# EAGLE design Facec (EAGLE 6.1)
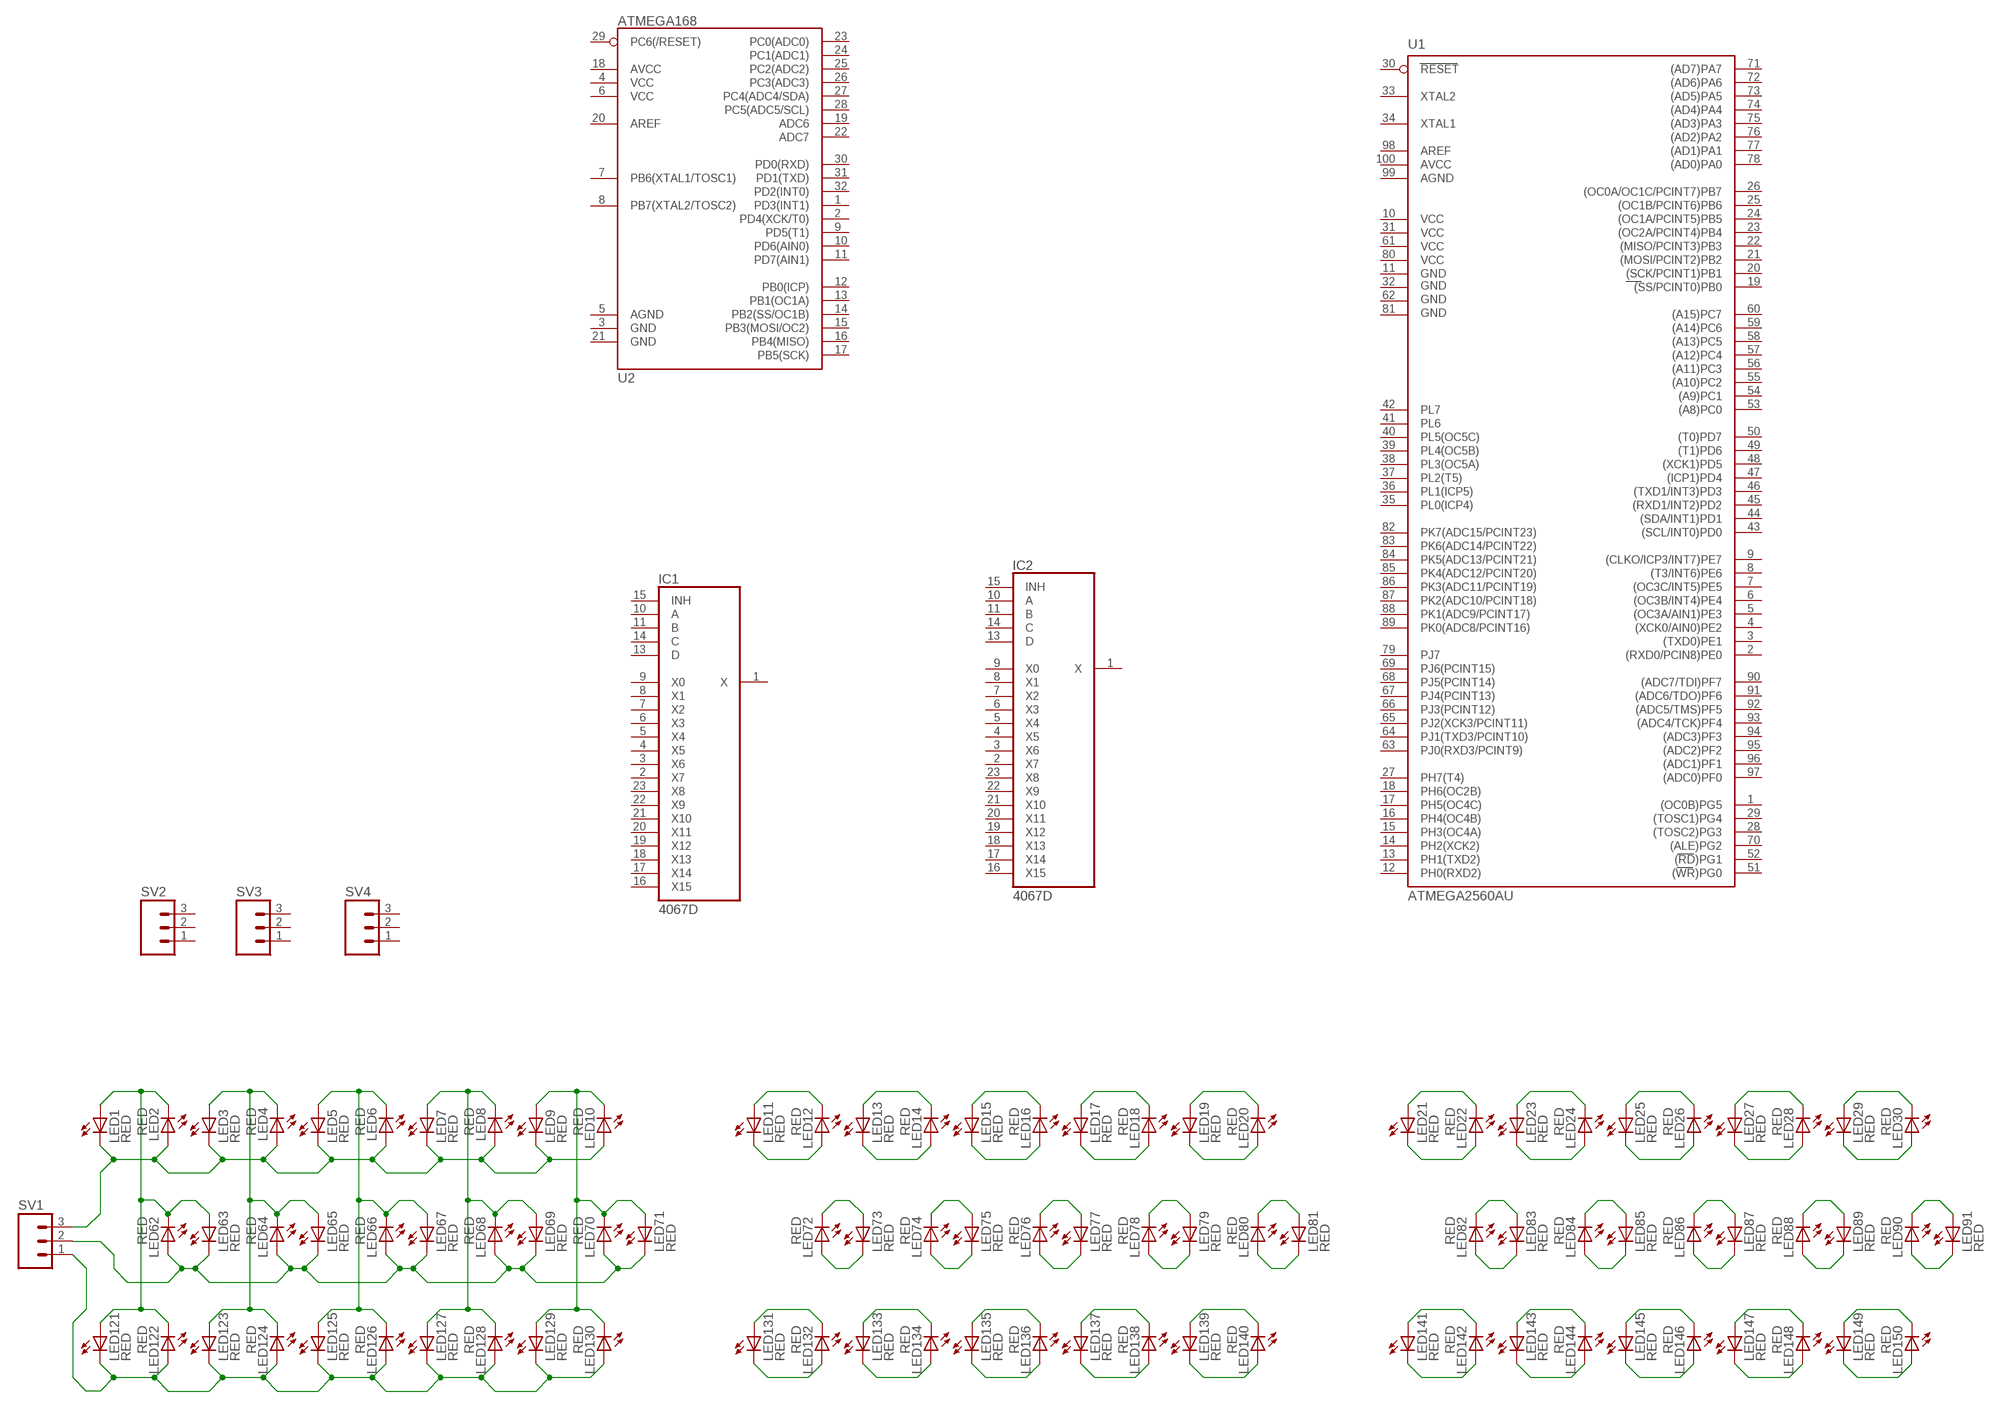
[diagram p0: schematic, sheet 1, part 1 of 2]
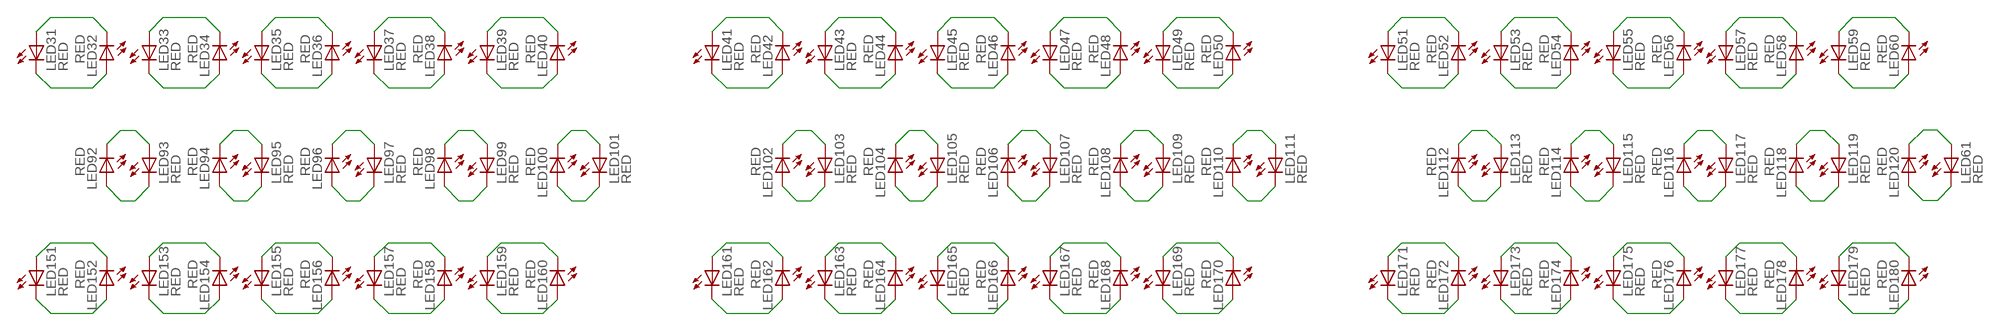
[diagram p1: schematic, sheet 1, part 2 of 2]

## Parts
IC1  4067D  [SO24W]
IC2  4067D  [SO24W]
LED1  RED  LED0603  [LED-0603]
LED2  RED  LED0603  [LED-0603]
LED3  RED  LED0603  [LED-0603]
LED4  RED  LED0603  [LED-0603]
LED5  RED  LED0603  [LED-0603]
LED6  RED  LED0603  [LED-0603]
LED7  RED  LED0603  [LED-0603]
LED8  RED  LED0603  [LED-0603]
LED9  RED  LED0603  [LED-0603]
LED10  RED  LED0603  [LED-0603]
LED11  RED  LED0603  [LED-0603]
LED12  RED  LED0603  [LED-0603]
LED13  RED  LED0603  [LED-0603]
LED14  RED  LED0603  [LED-0603]
LED15  RED  LED0603  [LED-0603]
LED16  RED  LED0603  [LED-0603]
LED17  RED  LED0603  [LED-0603]
LED18  RED  LED0603  [LED-0603]
LED19  RED  LED0603  [LED-0603]
LED20  RED  LED0603  [LED-0603]
LED21  RED  LED0603  [LED-0603]
LED22  RED  LED0603  [LED-0603]
LED23  RED  LED0603  [LED-0603]
LED24  RED  LED0603  [LED-0603]
LED25  RED  LED0603  [LED-0603]
LED26  RED  LED0603  [LED-0603]
LED27  RED  LED0603  [LED-0603]
LED28  RED  LED0603  [LED-0603]
LED29  RED  LED0603  [LED-0603]
LED30  RED  LED0603  [LED-0603]
LED31  RED  LED0603  [LED-0603]
LED32  RED  LED0603  [LED-0603]
LED33  RED  LED0603  [LED-0603]
LED34  RED  LED0603  [LED-0603]
LED35  RED  LED0603  [LED-0603]
LED36  RED  LED0603  [LED-0603]
LED37  RED  LED0603  [LED-0603]
LED38  RED  LED0603  [LED-0603]
LED39  RED  LED0603  [LED-0603]
LED40  RED  LED0603  [LED-0603]
LED41  RED  LED0603  [LED-0603]
LED42  RED  LED0603  [LED-0603]
LED43  RED  LED0603  [LED-0603]
LED44  RED  LED0603  [LED-0603]
LED45  RED  LED0603  [LED-0603]
LED46  RED  LED0603  [LED-0603]
LED47  RED  LED0603  [LED-0603]
LED48  RED  LED0603  [LED-0603]
LED49  RED  LED0603  [LED-0603]
LED50  RED  LED0603  [LED-0603]
LED51  RED  LED0603  [LED-0603]
LED52  RED  LED0603  [LED-0603]
LED53  RED  LED0603  [LED-0603]
LED54  RED  LED0603  [LED-0603]
LED55  RED  LED0603  [LED-0603]
LED56  RED  LED0603  [LED-0603]
LED57  RED  LED0603  [LED-0603]
LED58  RED  LED0603  [LED-0603]
LED59  RED  LED0603  [LED-0603]
LED60  RED  LED0603  [LED-0603]
LED61  RED  LED0603  [LED-0603]
LED62  RED  LED0603  [LED-0603]
LED63  RED  LED0603  [LED-0603]
LED64  RED  LED0603  [LED-0603]
LED65  RED  LED0603  [LED-0603]
LED66  RED  LED0603  [LED-0603]
LED67  RED  LED0603  [LED-0603]
LED68  RED  LED0603  [LED-0603]
LED69  RED  LED0603  [LED-0603]
LED70  RED  LED0603  [LED-0603]
LED71  RED  LED0603  [LED-0603]
LED72  RED  LED0603  [LED-0603]
LED73  RED  LED0603  [LED-0603]
LED74  RED  LED0603  [LED-0603]
LED75  RED  LED0603  [LED-0603]
LED76  RED  LED0603  [LED-0603]
LED77  RED  LED0603  [LED-0603]
LED78  RED  LED0603  [LED-0603]
LED79  RED  LED0603  [LED-0603]
LED80  RED  LED0603  [LED-0603]
LED81  RED  LED0603  [LED-0603]
LED82  RED  LED0603  [LED-0603]
LED83  RED  LED0603  [LED-0603]
LED84  RED  LED0603  [LED-0603]
LED85  RED  LED0603  [LED-0603]
LED86  RED  LED0603  [LED-0603]
LED87  RED  LED0603  [LED-0603]
LED88  RED  LED0603  [LED-0603]
LED89  RED  LED0603  [LED-0603]
LED90  RED  LED0603  [LED-0603]
LED91  RED  LED0603  [LED-0603]
LED92  RED  LED0603  [LED-0603]
LED93  RED  LED0603  [LED-0603]
LED94  RED  LED0603  [LED-0603]
LED95  RED  LED0603  [LED-0603]
LED96  RED  LED0603  [LED-0603]
LED97  RED  LED0603  [LED-0603]
LED98  RED  LED0603  [LED-0603]
LED99  RED  LED0603  [LED-0603]
LED100  RED  LED0603  [LED-0603]
LED101  RED  LED0603  [LED-0603]
LED102  RED  LED0603  [LED-0603]
LED103  RED  LED0603  [LED-0603]
LED104  RED  LED0603  [LED-0603]
LED105  RED  LED0603  [LED-0603]
LED106  RED  LED0603  [LED-0603]
LED107  RED  LED0603  [LED-0603]
LED108  RED  LED0603  [LED-0603]
LED109  RED  LED0603  [LED-0603]
LED110  RED  LED0603  [LED-0603]
LED111  RED  LED0603  [LED-0603]
LED112  RED  LED0603  [LED-0603]
LED113  RED  LED0603  [LED-0603]
LED114  RED  LED0603  [LED-0603]
LED115  RED  LED0603  [LED-0603]
LED116  RED  LED0603  [LED-0603]
LED117  RED  LED0603  [LED-0603]
LED118  RED  LED0603  [LED-0603]
LED119  RED  LED0603  [LED-0603]
LED120  RED  LED0603  [LED-0603]
LED121  RED  LED0603  [LED-0603]
LED122  RED  LED0603  [LED-0603]
LED123  RED  LED0603  [LED-0603]
LED124  RED  LED0603  [LED-0603]
LED125  RED  LED0603  [LED-0603]
LED126  RED  LED0603  [LED-0603]
LED127  RED  LED0603  [LED-0603]
LED128  RED  LED0603  [LED-0603]
LED129  RED  LED0603  [LED-0603]
LED130  RED  LED0603  [LED-0603]
LED131  RED  LED0603  [LED-0603]
LED132  RED  LED0603  [LED-0603]
LED133  RED  LED0603  [LED-0603]
LED134  RED  LED0603  [LED-0603]
LED135  RED  LED0603  [LED-0603]
LED136  RED  LED0603  [LED-0603]
LED137  RED  LED0603  [LED-0603]
LED138  RED  LED0603  [LED-0603]
LED139  RED  LED0603  [LED-0603]
LED140  RED  LED0603  [LED-0603]
LED141  RED  LED0603  [LED-0603]
LED142  RED  LED0603  [LED-0603]
LED143  RED  LED0603  [LED-0603]
LED144  RED  LED0603  [LED-0603]
LED145  RED  LED0603  [LED-0603]
LED146  RED  LED0603  [LED-0603]
LED147  RED  LED0603  [LED-0603]
LED148  RED  LED0603  [LED-0603]
LED149  RED  LED0603  [LED-0603]
LED150  RED  LED0603  [LED-0603]
LED151  RED  LED0603  [LED-0603]
LED152  RED  LED0603  [LED-0603]
LED153  RED  LED0603  [LED-0603]
LED154  RED  LED0603  [LED-0603]
LED155  RED  LED0603  [LED-0603]
LED156  RED  LED0603  [LED-0603]
LED157  RED  LED0603  [LED-0603]
LED158  RED  LED0603  [LED-0603]
LED159  RED  LED0603  [LED-0603]
LED160  RED  LED0603  [LED-0603]
LED161  RED  LED0603  [LED-0603]
LED162  RED  LED0603  [LED-0603]
LED163  RED  LED0603  [LED-0603]
LED164  RED  LED0603  [LED-0603]
LED165  RED  LED0603  [LED-0603]
LED166  RED  LED0603  [LED-0603]
LED167  RED  LED0603  [LED-0603]
LED168  RED  LED0603  [LED-0603]
LED169  RED  LED0603  [LED-0603]
LED170  RED  LED0603  [LED-0603]
LED171  RED  LED0603  [LED-0603]
LED172  RED  LED0603  [LED-0603]
LED173  RED  LED0603  [LED-0603]
LED174  RED  LED0603  [LED-0603]
LED175  RED  LED0603  [LED-0603]
LED176  RED  LED0603  [LED-0603]
LED177  RED  LED0603  [LED-0603]
LED178  RED  LED0603  [LED-0603]
LED179  RED  LED0603  [LED-0603]
LED180  RED  LED0603  [LED-0603]
SV1  M03PTH  [1X03]
SV2  M03PTH  [1X03]
SV3  M03PTH  [1X03]
SV4  M03PTH  [1X03]
U1  ATMEGA2560AU  [TQFP100]
U2  ATMEGA168  [TQFP32-08]

## Nets
N$1: LED1.A LED2.C LED62.C LED63.A LED121.A LED122.C
N$2: LED3.A LED4.C LED64.C LED65.A LED123.A LED124.C
N$3: LED5.A LED6.C LED66.C LED67.A LED125.A LED126.C
N$4: LED7.A LED8.C LED68.C LED69.A LED127.A LED128.C
N$5: LED9.A LED10.C LED70.C LED71.A LED129.A LED130.C
N$6: LED11.A LED12.C
N$7: LED13.A LED14.C
N$8: LED15.A LED16.C
N$9: LED17.A LED18.C
N$10: LED19.A LED20.C
N$11: LED21.A LED22.C
N$12: LED23.A LED24.C
N$13: LED25.A LED26.C
N$14: LED27.A LED28.C
N$15: LED29.A LED30.C
N$16: LED31.A LED32.C
N$17: LED33.A LED34.C
N$18: LED35.A LED36.C
N$19: LED37.A LED38.C
N$20: LED39.A LED40.C
N$21: LED41.A LED42.C
N$22: LED43.A LED44.C
N$23: LED45.A LED46.C
N$24: LED47.A LED48.C
N$25: LED49.A LED50.C
N$26: LED51.A LED52.C
N$27: LED53.A LED54.C
N$28: LED55.A LED56.C
N$29: LED57.A LED58.C
N$30: LED59.A LED60.C
N$31: LED121.C LED122.A LED123.C LED124.A LED125.C LED126.A LED127.C LED128.A LED129.C LED130.A SV1.1
N$36: LED72.C LED73.A
N$37: LED74.C LED75.A
N$38: LED76.C LED77.A
N$39: LED78.C LED79.A
N$40: LED80.C LED81.A
N$41: LED82.C LED83.A
N$42: LED84.C LED85.A
N$43: LED86.C LED87.A
N$44: LED88.C LED89.A
N$45: LED90.C LED91.A
N$46: LED92.C LED93.A
N$47: LED94.C LED95.A
N$48: LED96.C LED97.A
N$49: LED98.C LED99.A
N$50: LED100.C LED101.A
N$51: LED102.C LED103.A
N$52: LED104.C LED105.A
N$53: LED106.C LED107.A
N$54: LED108.C LED109.A
N$55: LED110.C LED111.A
N$56: LED112.C LED113.A
N$57: LED114.C LED115.A
N$58: LED116.C LED117.A
N$59: LED118.C LED119.A
N$60: LED61.A LED120.C
N$66: LED131.A LED132.C
N$67: LED133.A LED134.C
N$68: LED135.A LED136.C
N$69: LED137.A LED138.C
N$70: LED139.A LED140.C
N$71: LED141.A LED142.C
N$72: LED143.A LED144.C
N$73: LED145.A LED146.C
N$74: LED147.A LED148.C
N$75: LED149.A LED150.C
N$76: LED151.A LED152.C
N$77: LED153.A LED154.C
N$78: LED155.A LED156.C
N$79: LED157.A LED158.C
N$80: LED159.A LED160.C
N$81: LED161.A LED162.C
N$82: LED163.A LED164.C
N$83: LED165.A LED166.C
N$84: LED167.A LED168.C
N$85: LED169.A LED170.C
N$86: LED171.A LED172.C
N$87: LED173.A LED174.C
N$88: LED175.A LED176.C
N$89: LED177.A LED178.C
N$90: LED179.A LED180.C
N$91: LED1.C LED2.A LED3.C LED4.A LED5.C LED6.A LED7.C LED8.A LED9.C LED10.A SV1.3
N$96: LED11.C LED12.A
N$97: LED13.C LED14.A
N$98: LED15.C LED16.A
N$99: LED17.C LED18.A
N$100: LED19.C LED20.A
N$101: LED21.C LED22.A
N$102: LED23.C LED24.A
N$103: LED25.C LED26.A
N$104: LED27.C LED28.A
N$105: LED29.C LED30.A
N$106: LED31.C LED32.A
N$107: LED33.C LED34.A
N$108: LED35.C LED36.A
N$109: LED37.C LED38.A
N$110: LED39.C LED40.A
N$111: LED41.C LED42.A
N$112: LED43.C LED44.A
N$113: LED45.C LED46.A
N$114: LED47.C LED48.A
N$115: LED49.C LED50.A
N$116: LED51.C LED52.A
N$117: LED53.C LED54.A
N$118: LED55.C LED56.A
N$119: LED57.C LED58.A
N$120: LED59.C LED60.A
N$121: LED62.A LED63.C LED64.A LED65.C LED66.A LED67.C LED68.A LED69.C LED70.A LED71.C SV1.2
N$126: LED72.A LED73.C
N$127: LED74.A LED75.C
N$128: LED76.A LED77.C
N$129: LED78.A LED79.C
N$130: LED80.A LED81.C
N$131: LED82.A LED83.C
N$132: LED84.A LED85.C
N$133: LED86.A LED87.C
N$134: LED88.A LED89.C
N$135: LED90.A LED91.C
N$136: LED92.A LED93.C
N$137: LED94.A LED95.C
N$138: LED96.A LED97.C
N$139: LED98.A LED99.C
N$140: LED100.A LED101.C
N$141: LED102.A LED103.C
N$142: LED104.A LED105.C
N$143: LED106.A LED107.C
N$144: LED108.A LED109.C
N$145: LED110.A LED111.C
N$146: LED112.A LED113.C
N$147: LED114.A LED115.C
N$148: LED116.A LED117.C
N$149: LED118.A LED119.C
N$150: LED61.C LED120.A
N$156: LED131.C LED132.A
N$157: LED133.C LED134.A
N$158: LED135.C LED136.A
N$159: LED137.C LED138.A
N$160: LED139.C LED140.A
N$161: LED141.C LED142.A
N$162: LED143.C LED144.A
N$163: LED145.C LED146.A
N$164: LED147.C LED148.A
N$165: LED149.C LED150.A
N$166: LED151.C LED152.A
N$167: LED153.C LED154.A
N$168: LED155.C LED156.A
N$169: LED157.C LED158.A
N$170: LED159.C LED160.A
N$171: LED161.C LED162.A
N$172: LED163.C LED164.A
N$173: LED165.C LED166.A
N$174: LED167.C LED168.A
N$175: LED169.C LED170.A
N$176: LED171.C LED172.A
N$177: LED173.C LED174.A
N$178: LED175.C LED176.A
N$179: LED177.C LED178.A
N$180: LED179.C LED180.A
Unconnected: IC1.1(X) IC1.2(X7) IC1.3(X6) IC1.4(X5) IC1.5(X4) IC1.6(X3) IC1.7(X2) IC1.8(X1) IC1.9(X0) IC1.10(A) IC1.11(B) IC1.13(D) IC1.14(C) IC1.15(INH) IC1.16(X15) IC1.17(X14) IC1.18(X13) IC1.19(X12) IC1.20(X11) IC1.21(X10) IC1.22(X9) IC1.23(X8) IC2.1(X) IC2.2(X7) IC2.3(X6) IC2.4(X5) IC2.5(X4) IC2.6(X3) IC2.7(X2) IC2.8(X1) IC2.9(X0) IC2.10(A) IC2.11(B) IC2.13(D) IC2.14(C) IC2.15(INH) IC2.16(X15) IC2.17(X14) IC2.18(X13) IC2.19(X12) IC2.20(X11) IC2.21(X10) IC2.22(X9) IC2.23(X8) SV2.1 SV2.2 SV2.3 SV3.1 SV3.2 SV3.3 SV4.1 SV4.2 SV4.3 U1.1((OC0B)PG5) U1.2((RXD0/PCIN8)PE0) U1.3((TXD0)PE1) U1.4((XCK0/AIN0)PE2) U1.5((OC3A/AIN1)PE3) U1.6((OC3B/INT4)PE4) U1.7((OC3C/INT5)PE5) U1.8((T3/INT6)PE6) U1.9((CLKO/ICP3/INT7)PE7) U1.12(PH0(RXD2)) U1.13(PH1(TXD2)) U1.14(PH2(XCK2)) U1.15(PH3(OC4A)) U1.16(PH4(OC4B)) U1.17(PH5(OC4C)) U1.18(PH6(OC2B)) U1.19((SS/PCINT0)PB0) U1.20((SCK/PCINT1)PB1) U1.21((MOSI/PCINT2)PB2) U1.22((MISO/PCINT3)PB3) U1.23((OC2A/PCINT4)PB4) U1.24((OC1A/PCINT5)PB5) U1.25((OC1B/PCINT6)PB6) U1.26((OC0A/OC1C/PCINT7)PB7) U1.27(PH7(T4)) U1.28((TOSC2)PG3) U1.29((TOSC1)PG4) U1.30(RESET) U1.33(XTAL2) U1.34(XTAL1) U1.35(PL0(ICP4)) U1.36(PL1(ICP5)) U1.37(PL2(T5)) U1.38(PL3(OC5A)) U1.39(PL4(OC5B)) U1.40(PL5(OC5C)) U1.41(PL6) U1.42(PL7) U1.43((SCL/INT0)PD0) U1.44((SDA/INT1)PD1) U1.45((RXD1/INT2)PD2) U1.46((TXD1/INT3)PD3) U1.47((ICP1)PD4) U1.48((XCK1)PD5) U1.49((T1)PD6) U1.50((T0)PD7) U1.51((WR)PG0) U1.52((RD)PG1) U1.53((A8)PC0) U1.54((A9)PC1) U1.55((A10)PC2) U1.56((A11)PC3) U1.57((A12)PC4) U1.58((A13)PC5) U1.59((A14)PC6) U1.60((A15)PC7) U1.63(PJ0(RXD3/PCINT9)) U1.64(PJ1(TXD3/PCINT10)) U1.65(PJ2(XCK3/PCINT11)) U1.66(PJ3(PCINT12)) U1.67(PJ4(PCINT13)) U1.68(PJ5(PCINT14)) U1.69(PJ6(PCINT15)) U1.70((ALE)PG2) U1.71((AD7)PA7) U1.72((AD6)PA6) U1.73((AD5)PA5) U1.74((AD4)PA4) U1.75((AD3)PA3) U1.76((AD2)PA2) U1.77((AD1)PA1) U1.78((AD0)PA0) U1.79(PJ7) U1.82(PK7(ADC15/PCINT23)) U1.83(PK6(ADC14/PCINT22)) U1.84(PK5(ADC13/PCINT21)) U1.85(PK4(ADC12/PCINT20)) U1.86(PK3(ADC11/PCINT19)) U1.87(PK2(ADC10/PCINT18)) U1.88(PK1(ADC9/PCINT17)) U1.89(PK0(ADC8/PCINT16)) U1.90((ADC7/TDI)PF7) U1.91((ADC6/TDO)PF6) U1.92((ADC5/TMS)PF5) U1.93((ADC4/TCK)PF4) U1.94((ADC3)PF3) U1.95((ADC2)PF2) U1.96((ADC1)PF1) U1.97((ADC0)PF0) U1.98(AREF) U2.1(PD3(INT1)) U2.2(PD4(XCK/T0)) U2.3(GND) U2.4(VCC) U2.5(AGND) U2.6(VCC) U2.7(PB6(XTAL1/TOSC1)) U2.8(PB7(XTAL2/TOSC2)) U2.9(PD5(T1)) U2.10(PD6(AIN0)) U2.11(PD7(AIN1)) U2.12(PB0(ICP)) U2.13(PB1(OC1A)) U2.14(PB2(SS/OC1B)) U2.15(PB3(MOSI/OC2)) U2.16(PB4(MISO)) U2.17(PB5(SCK)) U2.18(AVCC) U2.19(ADC6) U2.20(AREF) U2.21(GND) U2.22(ADC7) U2.23(PC0(ADC0)) U2.24(PC1(ADC1)) U2.25(PC2(ADC2)) U2.26(PC3(ADC3)) U2.27(PC4(ADC4/SDA)) U2.28(PC5(ADC5/SCL)) U2.29(PC6(/RESET)) U2.30(PD0(RXD)) U2.31(PD1(TXD)) U2.32(PD2(INT0))

## Power pins joined to a net without a drawn wire
AGND: U1.99(AGND)
AVCC: U1.100(AVCC)
GND: U1.11(GND)
GND1: U1.32(GND1)
GND2: U1.62(GND2)
GND3: U1.81(GND3)
VCC: U1.10(VCC)
VCC1: U1.31(VCC1)
VCC2: U1.61(VCC2)
VCC3: U1.80(VCC3)
VDD: IC1.24(VDD) IC2.24(VDD)
VSS: IC1.12(VSS) IC2.12(VSS)

## Library data of the parts
IC1 IC2 = 40xx:4067: 16-channel ANALOG MULTIPLEXER
LED1-LED180 = SparkFun-LED:LED: LEDs Standard schematic elements and footprints for 5mm, 3mm, 1206, and 0603 sized LEDs. 5mm - Spark Fun Electronics SKU : COM-00529 (and others)
SV1-SV4 = SparkFun-Connectors:M03: Header 3 Standard 3-pin 0.1" header. Use with straight break away headers (SKU : PRT-00116), right angle break away headers (PRT-00553), swiss pins (PRT-00743), machine pins (PRT-00117), and female headers (PRT-00115). Molex polarized connector foot print use with SKU : PRT-08232 with associated crimp pins and housings.
U1 = SparkFun-DigitalIC:ATMEGA2560: Atmel 100-pin 8-bit uC 64/128/256 Kbytes FLASH 4 Kbytes EEPROM 8 Kbytes SRAM 86 General Purpose I/O pins 12-channels16-bit PWM 4 x Serial USARTs 16-channels 10-bit A/D
U2 = SparkFun-DigitalIC:ATMEGA168: Atmel 32-pin 8-bit micro, 16k flash.

## Board
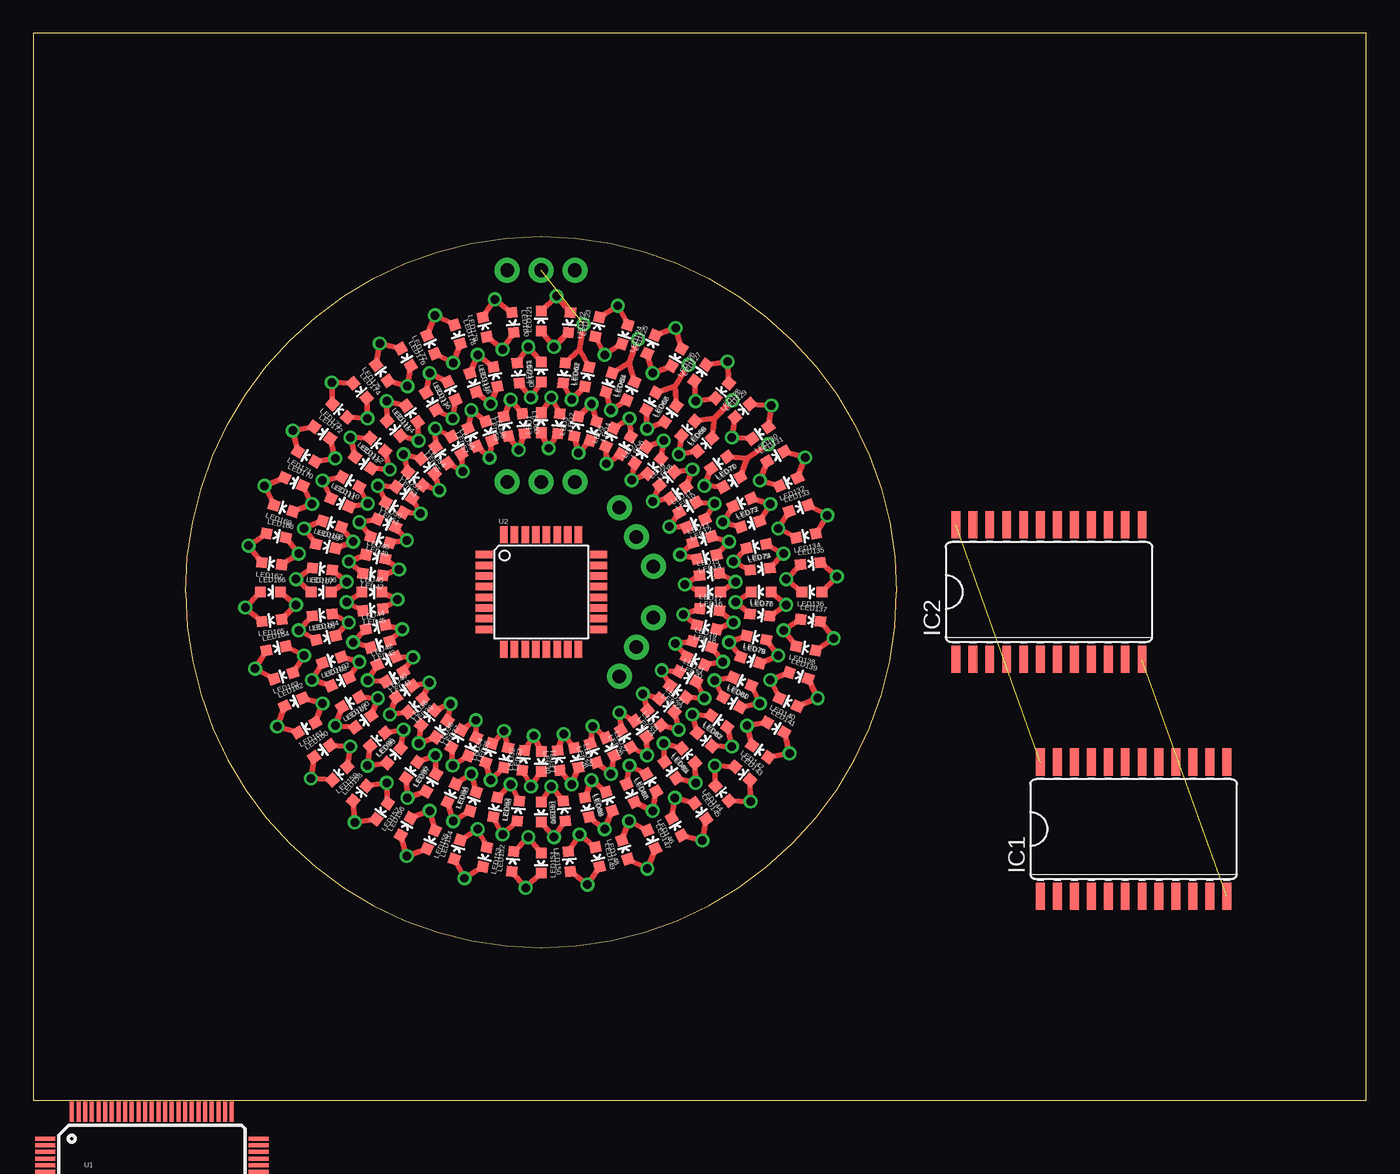
[diagram p2: board, top side]
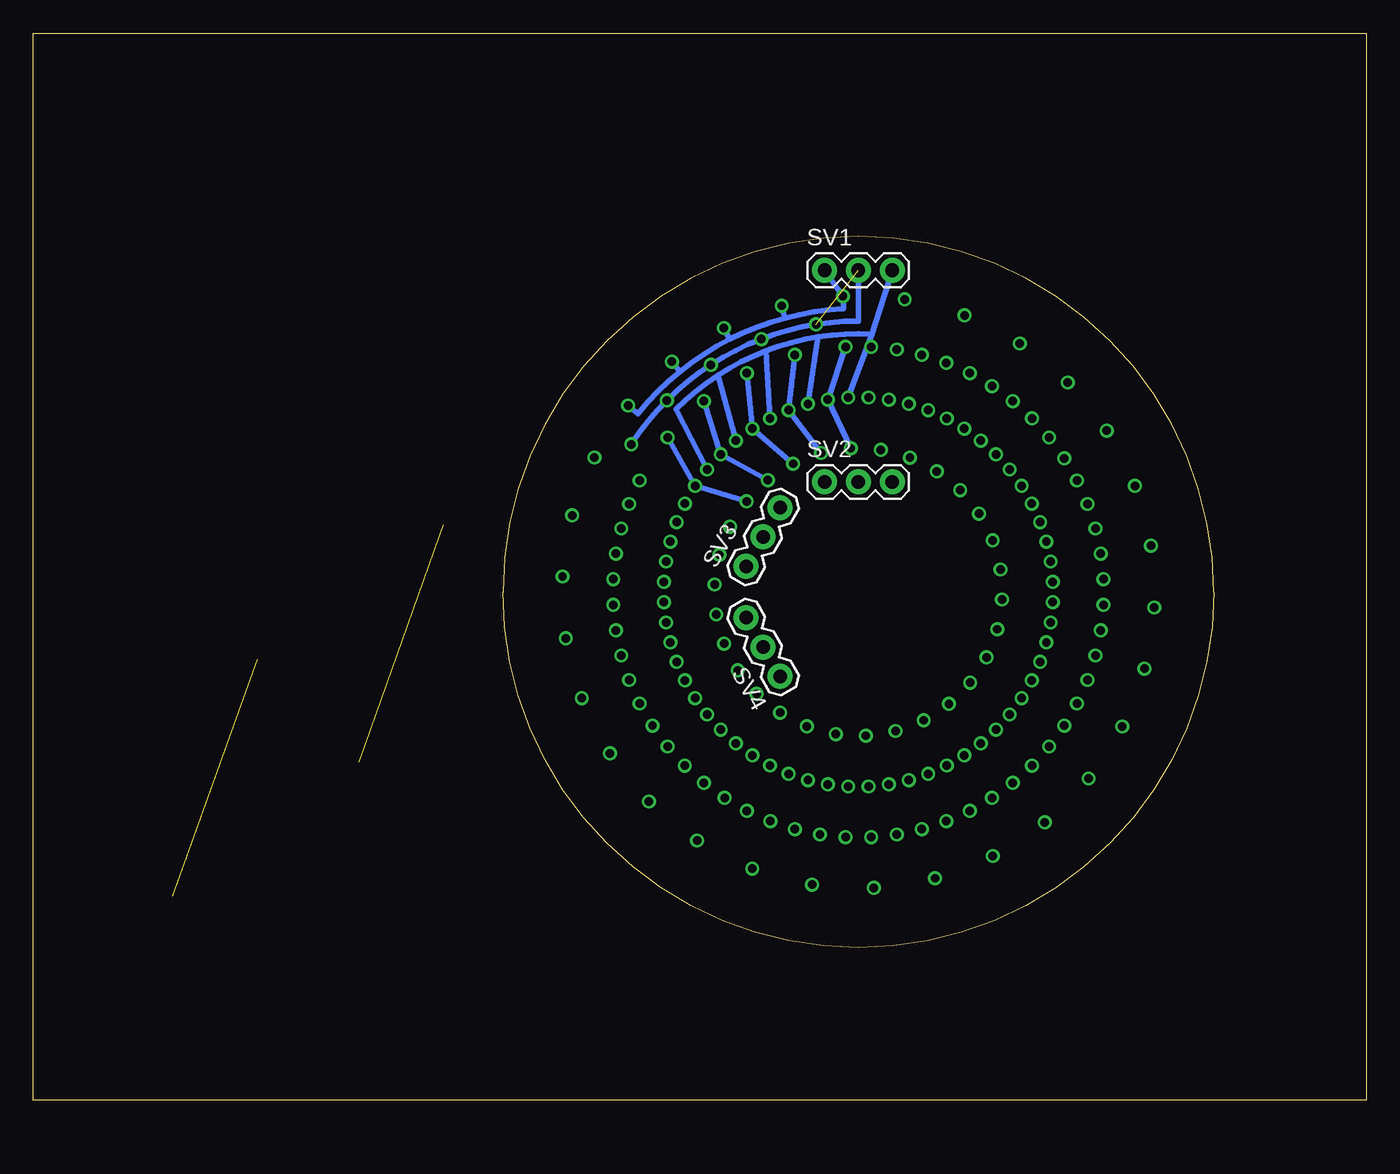
[diagram p3: board, bottom side, seen from below]

Size 100 x 80 mm. Coordinates in mm from the lower left corner, seen from the top.
Outline: 0,0 100,0 100,80 0,80 0,0
Outline: 11.43,38.1 arc180 64.77,38.1 arc180 11.43,38.1
Copper layers (1*16): Top 0.035mm / dielectric 1.5mm / Bottom 0.035mm
Design rules: minimum track width 10mil, minimum drill 24mil, track to track 8mil, track to pad 8mil, pad to pad 8mil, via to via 8mil, smd to smd 8mil, copper to edge 40mil, drill to drill 8mil, minimum pad ring 10mil, minimum via ring 8mil, stop-mask expansion 4mil, vias tented up to drill 0mil, thermal gap 10mil

### Footprints (pad centres in the part's own frame; a part is rotated, then mirrored left to right if it is on the bottom)
SO24W = smd 0.66 x 2.032: 1 -6.985,-5.029; 2 -5.715,-5.029; 3 -4.445,-5.029; 4 -3.175,-5.029; 5 -1.905,-5.029; 6 -0.635,-5.029; 7 0.635,-5.029; 8 1.905,-5.029; 9 3.175,-5.029; 10 4.445,-5.029; 11 5.715,-5.029; 12 6.985,-5.029; 13 6.985,5.029; 14 5.715,5.029; 15 4.445,5.029; 16 3.175,5.029; 17 1.905,5.029; 18 0.635,5.029; 19 -0.635,5.029; 20 -1.905,5.029; 21 -3.175,5.029; 22 -4.445,5.029; 23 -5.715,5.029; 24 -6.985,5.029
LED-0603 = smd 0.8 x 0.8: A 0,-0.75; C 0,0.75
1X03 = drill 1.016 pad 1.88: 1 0,0; 2 2.54,0; 3 5.08,0
TQFP100 = smd 1.5 x 0.3: 1 -8,6; 2 -8,5.5; 3 -8,5; 4 -8,4.5; 5 -8,4; 6 -8,3.5; 7 -8,3; 8 -8,2.5; 9 -8,2; 10 -8,1.5; 11 -8,1; 12 -8,0.5; 13 -8,0; 14 -8,-0.5; 15 -8,-1; 16 -8,-1.5; 17 -8,-2; 18 -8,-2.5; 19 -8,-3; 20 -8,-3.5; 21 -8,-4; 22 -8,-4.5; 23 -8,-5; 24 -8,-5.5; 25 -8,-6; 51 8,-6; 52 8,-5.5; 53 8,-5; 54 8,-4.5; 55 8,-4; 56 8,-3.5; 57 8,-3; 58 8,-2.5; 59 8,-2; 60 8,-1.5; 61 8,-1; 62 8,-0.5; 63 8,0; 64 8,0.5; 65 8,1; 66 8,1.5; 67 8,2; 68 8,2.5; 69 8,3; 70 8,3.5; 71 8,4; 72 8,4.5; 73 8,5; 74 8,5.5; 75 8,6 | smd 0.3 x 1.5: 26 -6,-8; 27 -5.5,-8; 28 -5,-8; 29 -4.5,-8; 30 -4,-8; 31 -3.5,-8; 32 -3,-8; 33 -2.5,-8; 34 -2,-8; 35 -1.5,-8; 36 -1,-8; 37 -0.5,-8; 38 0,-8; 39 0.5,-8; 40 1,-8; 41 1.5,-8; 42 2,-8; 43 2.5,-8; 44 3,-8; 45 3.5,-8; 46 4,-8; 47 4.5,-8; 48 5,-8; 49 5.5,-8; 50 6,-8; 76 6,8; 77 5.5,8; 78 5,8; 79 4.5,8; 80 4,8; 81 3.5,8; 82 3,8; 83 2.5,8; 84 2,8; 85 1.5,8; 86 1,8; 87 0.5,8; 88 0,8; 89 -0.5,8; 90 -1,8; 91 -1.5,8; 92 -2,8; 93 -2.5,8; 94 -3,8; 95 -3.5,8; 96 -4,8; 97 -4.5,8; 98 -5,8; 99 -5.5,8; 100 -6,8
TQFP32-08 = smd 1.27 x 0.559: 1 -4.293,2.8; 2 -4.293,2; 3 -4.293,1.2; 4 -4.293,0.4; 5 -4.293,-0.4; 6 -4.293,-1.2; 7 -4.293,-2; 8 -4.293,-2.8; 17 4.293,-2.8; 18 4.293,-2; 19 4.293,-1.2; 20 4.293,-0.4; 21 4.293,0.4; 22 4.293,1.2; 23 4.293,2; 24 4.293,2.8 | smd 0.559 x 1.27: 9 -2.8,-4.293; 10 -2,-4.293; 11 -1.2,-4.293; 12 -0.4,-4.293; 13 0.4,-4.293; 14 1.2,-4.293; 15 2,-4.293; 16 2.8,-4.293; 25 2.8,4.293; 26 2,4.293; 27 1.2,4.293; 28 0.4,4.293; 29 -0.4,4.293; 30 -1.2,4.293; 31 -2,4.293; 32 -2.8,4.293

### Placement (x,y rotation side)
IC1  82.55,20.32 0 top
IC2  76.2,38.1 0 top
LED1  38.1,50.8 0 top
LED2  39.43,50.73 174 top
LED3  40.74,50.52 348 top
LED4  42.02,50.18 162 top
LED5  43.27,49.7 336 top
LED6  44.45,49.1 150 top
LED7  45.56,48.37 324 top
LED8  46.6,47.54 138 top
LED9  47.54,46.6 312 top
LED10  48.37,45.56 126 top
LED11  49.1,44.45 300 top
LED12  49.7,43.27 114 top
LED13  50.18,42.02 288 top
LED14  50.52,40.74 102 top
LED15  50.73,39.43 276 top
LED16  50.8,38.1 90 top
LED17  50.73,36.77 264 top
LED18  50.52,35.46 78 top
LED19  50.18,34.18 252 top
LED20  49.7,32.93 66 top
LED21  49.1,31.75 240 top
LED22  48.37,30.64 54 top
LED23  47.54,29.6 228 top
LED24  46.6,28.66 42 top
LED25  45.56,27.83 216 top
LED26  44.45,27.1 30 top
LED27  43.27,26.5 204 top
LED28  42.02,26.02 18 top
LED29  40.74,25.68 192 top
LED30  39.43,25.47 6 top
LED31  38.1,25.4 180 top
LED32  36.77,25.47 354 top
LED33  35.46,25.68 168 top
LED34  34.18,26.02 342 top
LED35  32.93,26.5 156 top
LED36  31.75,27.1 330 top
LED37  30.64,27.83 144 top
LED38  29.6,28.66 318 top
LED39  28.66,29.6 132 top
LED40  27.83,30.64 306 top
LED41  27.1,31.75 120 top
LED42  26.5,32.93 294 top
LED43  26.02,34.18 108 top
LED44  25.68,35.46 282 top
LED45  25.47,36.77 96 top
LED46  25.4,38.1 270 top
LED47  25.47,39.43 84 top
LED48  25.68,40.74 258 top
LED49  26.02,42.02 72 top
LED50  26.5,43.27 246 top
LED51  27.1,44.45 60 top
LED52  27.83,45.56 234 top
LED53  28.66,46.6 48 top
LED54  29.6,47.54 222 top
LED55  30.64,48.37 36 top
LED56  31.75,49.1 210 top
LED57  32.93,49.7 24 top
LED58  34.18,50.18 198 top
LED59  35.46,50.52 12 top
LED60  36.77,50.73 186 top
LED61  38.1,54.61 0 top
LED62  39.83,54.52 174 top
LED63  41.53,54.25 348 top
LED64  43.2,53.8 162 top
LED65  44.82,53.18 336 top
LED66  46.35,52.4 150 top
LED67  47.8,51.46 324 top
LED68  49.15,50.37 138 top
LED69  50.37,49.15 312 top
LED70  51.46,47.8 126 top
LED71  52.4,46.35 300 top
LED72  53.18,44.82 114 top
LED73  53.8,43.2 288 top
LED74  54.25,41.53 102 top
LED75  54.52,39.83 276 top
LED76  54.61,38.1 90 top
LED77  54.52,36.37 264 top
LED78  54.25,34.67 78 top
LED79  53.8,33 252 top
LED80  53.18,31.38 66 top
LED81  52.4,29.84 240 top
LED82  51.46,28.4 54 top
LED83  50.37,27.05 228 top
LED84  49.15,25.83 42 top
LED85  47.8,24.74 216 top
LED86  46.35,23.8 30 top
LED87  44.82,23.02 204 top
LED88  43.2,22.4 18 top
LED89  41.53,21.95 192 top
LED90  39.83,21.68 6 top
LED91  38.1,21.59 180 top
LED92  36.37,21.68 354 top
LED93  34.67,21.95 168 top
LED94  33,22.4 342 top
LED95  31.38,23.02 156 top
LED96  29.84,23.8 330 top
LED97  28.4,24.74 144 top
LED98  27.05,25.83 318 top
LED99  25.83,27.05 132 top
LED100  24.74,28.4 306 top
LED101  23.8,29.84 120 top
LED102  23.02,31.38 294 top
LED103  22.4,33 108 top
LED104  21.95,34.67 282 top
LED105  21.68,36.37 96 top
LED106  21.59,38.1 270 top
LED107  21.68,39.83 84 top
LED108  21.95,41.53 258 top
LED109  22.4,43.2 72 top
LED110  23.02,44.82 246 top
LED111  23.8,46.35 60 top
LED112  24.74,47.8 234 top
LED113  25.83,49.15 48 top
LED114  27.05,50.37 222 top
LED115  28.4,51.46 36 top
LED116  29.84,52.4 210 top
LED117  31.38,53.18 24 top
LED118  33,53.8 198 top
LED119  34.67,54.25 12 top
LED120  36.37,54.52 186 top
LED121  38.1,58.42 0 top
LED122  40.22,58.31 174 top
LED123  42.32,57.98 348 top
LED124  44.38,57.43 162 top
LED125  46.36,56.66 336 top
LED126  48.26,55.7 150 top
LED127  50.04,54.54 324 top
LED128  51.7,53.2 138 top
LED129  53.2,51.7 312 top
LED130  54.54,50.04 126 top
LED131  55.7,48.26 300 top
LED132  56.66,46.36 114 top
LED133  57.43,44.38 288 top
LED134  57.98,42.32 102 top
LED135  58.31,40.22 276 top
LED136  58.42,38.1 90 top
LED137  58.31,35.98 264 top
LED138  57.98,33.88 78 top
LED139  57.43,31.82 252 top
LED140  56.66,29.84 66 top
LED141  55.7,27.94 240 top
LED142  54.54,26.16 54 top
LED143  53.2,24.5 228 top
LED144  51.7,23 42 top
LED145  50.04,21.66 216 top
LED146  48.26,20.5 30 top
LED147  46.36,19.54 204 top
LED148  44.38,18.77 18 top
LED149  42.32,18.22 192 top
LED150  40.22,17.89 6 top
LED151  38.1,17.78 180 top
LED152  35.98,17.89 354 top
LED153  33.88,18.22 168 top
LED154  31.82,18.77 342 top
LED155  29.84,19.54 156 top
LED156  27.94,20.5 330 top
LED157  26.16,21.66 144 top
LED158  24.5,23 318 top
LED159  23,24.5 132 top
LED160  21.66,26.16 306 top
LED161  20.5,27.94 120 top
LED162  19.54,29.84 294 top
LED163  18.77,31.82 108 top
LED164  18.22,33.88 282 top
LED165  17.89,35.98 96 top
LED166  17.78,38.1 270 top
LED167  17.89,40.22 84 top
LED168  18.22,42.32 258 top
LED169  18.77,44.38 72 top
LED170  19.54,46.36 246 top
LED171  20.5,48.26 60 top
LED172  21.66,50.04 234 top
LED173  23,51.7 48 top
LED174  24.5,53.2 222 top
LED175  26.16,54.54 36 top
LED176  27.94,55.7 210 top
LED177  29.84,56.66 24 top
LED178  31.82,57.43 198 top
LED179  33.88,57.98 12 top
LED180  35.98,58.31 186 top
SV1  40.64,62.23 0 bottom
SV2  40.64,46.35 0 bottom
SV3  46.52,40.03 60 bottom
SV4  43.98,31.77 120 bottom
U1  8.89,-8.89 0 top
U2  38.1,38.1 0 top

### Tracks (layer width: path | path; a pad name or v marks a point on that pad's centre or on a via)
N$1  (via drill 0.64)
  Top 0.406: LED63.A v40.38,52.52 LED62.C | LED1.A v38.66,48.88 LED2.C | LED121.A v39.06,56.49 LED122.C
  Bottom 0.406: v38.66,48.88 v40.38,52.52 v39.06,56.49
N$2  (via drill 0.64)
  Top 0.406: LED4.C v40.89,48.53 LED3.A | LED124.C v42.87,55.89 LED123.A | LED65.A v43.33,51.73 LED64.C
  Bottom 0.406: v42.87,55.89 v43.33,51.73 v40.89,48.53
N$3  (via drill 0.64)
  Top 0.406: LED5.A v43,47.72 LED6.C | LED125.A v46.46,54.51 LED126.C | LED66.C v46.05,50.35 LED67.A
  Bottom 0.406: v43,47.72 v46.05,50.35 v46.46,54.51
N$4  (via drill 0.64)
  Top 0.406: LED7.A v44.89,46.49 LED8.C | LED127.A v49.69,52.41 LED128.C | LED68.C v48.43,48.43 LED69.A
  Bottom 0.406: v49.69,52.41 v48.43,48.43 v44.89,46.49
N$5  (via drill 0.64)
  Top 0.406: LED9.A v46.49,44.89 LED10.C | LED129.A v52.41,49.69 LED130.C | LED70.C v50.35,46.05 LED71.A
  Bottom 0.406: v46.49,44.89 v50.35,46.05 v52.41,49.69
N$6  (via drill 0.64)
  Top 0.406: LED11.A v47.72,43 LED12.C
N$7  (via drill 0.64)
  Top 0.406: LED13.A v48.53,40.89 LED14.C
N$8  (via drill 0.64)
  Top 0.406: LED15.A v48.88,38.66 LED16.C
N$9  (via drill 0.64)
  Top 0.406: LED17.A v48.76,36.41 LED18.C
N$10  (via drill 0.64)
  Top 0.406: LED19.A v48.18,34.23 LED20.C
N$11  (via drill 0.64)
  Top 0.406: LED21.A v47.15,32.22 LED22.C
N$12  (via drill 0.64)
  Top 0.406: LED23.A v45.73,30.47 LED24.C
N$13  (via drill 0.64)
  Top 0.406: LED25.A v43.98,29.05 LED26.C
N$14  (via drill 0.64)
  Top 0.406: LED27.A v41.97,28.02 LED28.C
N$15  (via drill 0.64)
  Top 0.406: LED29.A v39.79,27.44 LED30.C
N$16  (via drill 0.64)
  Top 0.406: LED31.A v37.53,27.32 LED32.C
N$17  (via drill 0.64)
  Top 0.406: LED33.A v35.31,27.67 LED34.C
N$18  (via drill 0.64)
  Top 0.406: LED35.A v33.2,28.48 LED36.C
N$19  (via drill 0.64)
  Top 0.406: LED37.A v31.31,29.71 LED38.C
N$20  (via drill 0.64)
  Top 0.406: LED39.A v29.71,31.31 LED40.C
N$21  (via drill 0.64)
  Top 0.406: LED41.A v28.48,33.2 LED42.C
N$22  (via drill 0.64)
  Top 0.406: LED43.A v27.67,35.31 LED44.C
N$23  (via drill 0.64)
  Top 0.406: LED46.C v27.32,37.53 LED45.A
N$24  (via drill 0.64)
  Top 0.406: LED48.C v27.44,39.79 LED47.A
N$25  (via drill 0.64)
  Top 0.406: LED50.C v28.02,41.97 LED49.A
N$26  (via drill 0.64)
  Top 0.406: LED52.C v29.05,43.98 LED51.A
N$27  (via drill 0.64)
  Top 0.406: LED54.C v30.47,45.73 LED53.A
N$28  (via drill 0.64)
  Top 0.406: LED56.C v32.22,47.15 LED55.A
N$29  (via drill 0.64)
  Top 0.406: LED58.C v34.23,48.18 LED57.A
N$30  (via drill 0.64)
  Top 0.406: LED59.A v36.41,48.76 LED60.C
N$31  (via drill 0.64)
  Top 0.406: LED121.C v39.26,60.3 LED122.A | LED123.C v43.85,59.57 LED124.A | LED126.A v48.19,57.9 LED125.C | LED128.A v52.09,55.37 LED127.C | LED129.C v55.37,52.09 LED130.A
  Bottom 0.406: v43.85,59.57 43.61,58.65 | v48.19,57.9 47.76,57.05 | v52.09,55.37 51.49,54.63 | v55.37,52.09 54.63,51.49 arc12 51.49,54.63 | 43.61,58.65 arc12 39.21,59.34 v39.26,60.3 SV1.1 | 43.61,58.65 arc-12 47.76,57.05 | 51.49,54.63 arc12 47.76,57.05
N$36  (via drill 0.64)
  Top 0.406: LED72.C v51.73,43.33 LED73.A
N$37  (via drill 0.64)
  Top 0.406: LED74.C v52.52,40.38 LED75.A
N$38  (via drill 0.64)
  Top 0.406: LED76.C v52.69,37.34 LED77.A
N$39  (via drill 0.64)
  Top 0.406: LED78.C v52.21,34.32 LED79.A
N$40  (via drill 0.64)
  Top 0.406: LED80.C v51.11,31.47 LED81.A
N$41  (via drill 0.64)
  Top 0.406: LED82.C v49.45,28.91 LED83.A
N$42  (via drill 0.64)
  Top 0.406: LED84.C v47.29,26.75 LED85.A
N$43  (via drill 0.64)
  Top 0.406: LED86.C v44.73,25.09 LED87.A
N$44  (via drill 0.64)
  Top 0.406: LED88.C v41.88,23.99 LED89.A
N$45  (via drill 0.64)
  Top 0.406: LED90.C v38.86,23.52 LED91.A
N$46  (via drill 0.64)
  Top 0.406: LED92.C v35.81,23.68 LED93.A
N$47  (via drill 0.64)
  Top 0.406: LED94.C v32.87,24.46 LED95.A
N$48  (via drill 0.64)
  Top 0.406: LED96.C v30.15,25.85 LED97.A
N$49  (via drill 0.64)
  Top 0.406: LED98.C v27.77,27.77 LED99.A
N$50  (via drill 0.64)
  Top 0.406: LED100.C v25.85,30.15 LED101.A
N$51  (via drill 0.64)
  Top 0.406: LED103.A v24.46,32.87 LED102.C
N$52  (via drill 0.64)
  Top 0.406: LED105.A v23.68,35.81 LED104.C
N$53  (via drill 0.64)
  Top 0.406: LED106.C v23.52,38.86 LED107.A
N$54  (via drill 0.64)
  Top 0.406: LED109.A v23.99,41.88 LED108.C
N$55  (via drill 0.64)
  Top 0.406: LED111.A v25.09,44.73 LED110.C
N$56  (via drill 0.64)
  Top 0.406: LED113.A v26.75,47.29 LED112.C
N$57  (via drill 0.64)
  Top 0.406: LED115.A v28.91,49.45 LED114.C
N$58  (via drill 0.64)
  Top 0.406: LED117.A v31.47,51.11 LED116.C
N$59  (via drill 0.64)
  Top 0.406: LED119.A v34.32,52.21 LED118.C
N$60  (via drill 0.64)
  Top 0.406: LED61.A v37.34,52.69 LED120.C
N$66  (via drill 0.64)
  Top 0.406: LED132.C v54.51,46.46 LED131.A
N$67  (via drill 0.64)
  Top 0.406: LED133.A v55.89,42.87 LED134.C
N$68  (via drill 0.64)
  Top 0.406: LED135.A v56.49,39.06 LED136.C
N$69  (via drill 0.64)
  Top 0.406: LED137.A v56.29,35.22 LED138.C
N$70  (via drill 0.64)
  Top 0.406: LED139.A v55.29,31.5 LED140.C
N$71  (via drill 0.64)
  Top 0.406: LED141.A v53.54,28.07 LED142.C
N$72  (via drill 0.64)
  Top 0.406: LED143.A v51.12,25.08 LED144.C
N$73  (via drill 0.64)
  Top 0.406: LED145.A v48.13,22.66 LED146.C
N$74  (via drill 0.64)
  Top 0.406: LED147.A v44.7,20.91 LED148.C
N$75  (via drill 0.64)
  Top 0.406: LED149.A v40.98,19.91 LED150.C
N$76  (via drill 0.64)
  Top 0.406: LED151.A v37.14,19.71 LED152.C
N$77  (via drill 0.64)
  Top 0.406: LED153.A v33.33,20.31 LED154.C
N$78  (via drill 0.64)
  Top 0.406: LED156.C v29.74,21.69 LED155.A
N$79  (via drill 0.64)
  Top 0.406: LED157.A v26.51,23.79 LED158.C
N$80  (via drill 0.64)
  Top 0.406: LED159.A v23.79,26.51 LED160.C
N$81  (via drill 0.64)
  Top 0.406: LED161.A v21.69,29.74 LED162.C
N$82  (via drill 0.64)
  Top 0.406: LED164.C v20.31,33.33 LED163.A
N$83  (via drill 0.64)
  Top 0.406: LED166.C v19.71,37.14 LED165.A
N$84  (via drill 0.64)
  Top 0.406: LED168.C v19.91,40.98 LED167.A
N$85  (via drill 0.64)
  Top 0.406: LED170.C v20.91,44.7 LED169.A
N$86  (via drill 0.64)
  Top 0.406: LED172.C v22.66,48.13 LED171.A
N$87  (via drill 0.64)
  Top 0.406: LED173.A v25.08,51.12 LED174.C
N$88  (via drill 0.64)
  Top 0.406: LED176.C v28.07,53.54 LED175.A
N$89  (via drill 0.64)
  Top 0.406: LED178.C v31.5,55.29 LED177.A
N$90  (via drill 0.64)
  Top 0.406: LED180.C v35.22,56.29 LED179.A
N$91  (via drill 0.64)
  Top 0.406: LED1.C v38.86,52.69 LED2.A | LED3.C v41.88,52.21 LED4.A | LED5.C v44.73,51.11 LED6.A | LED7.C v47.29,49.45 LED8.A | LED10.A v49.45,47.29 LED9.C
  Bottom 0.406: v41.88,52.21 41.13,57.23 | v38.86,52.69 37.09,57.44 | v44.73,51.11 45.04,56.18 | v47.29,49.45 48.65,54.34 | v49.45,47.29 51.8,51.8 arc12 48.65,54.34 | 41.13,57.23 arc12 37.09,57.44 | 45.04,56.18 arc12 41.13,57.23 | 48.65,54.34 arc12 45.04,56.18 | 37.09,57.44 SV1.3
N$96  (via drill 0.64)
  Top 0.406: LED11.C v51.11,44.73 LED12.A
N$97  (via drill 0.64)
  Top 0.406: LED13.C v52.21,41.88 LED14.A
N$98  (via drill 0.64)
  Top 0.406: LED15.C v52.69,38.86 LED16.A
N$99  (via drill 0.64)
  Top 0.406: LED17.C v52.52,35.81 LED18.A
N$100  (via drill 0.64)
  Top 0.406: LED19.C v51.73,32.87 LED20.A
N$101  (via drill 0.64)
  Top 0.406: LED21.C v50.35,30.15 LED22.A
N$102  (via drill 0.64)
  Top 0.406: LED23.C v48.43,27.77 LED24.A
N$103  (via drill 0.64)
  Top 0.406: LED25.C v46.05,25.85 LED26.A
N$104  (via drill 0.64)
  Top 0.406: LED27.C v43.33,24.46 LED28.A
N$105  (via drill 0.64)
  Top 0.406: LED29.C v40.38,23.68 LED30.A
N$106  (via drill 0.64)
  Top 0.406: LED31.C v37.34,23.52 LED32.A
N$107  (via drill 0.64)
  Top 0.406: LED33.C v34.32,23.99 LED34.A
N$108  (via drill 0.64)
  Top 0.406: LED35.C v31.47,25.09 LED36.A
N$109  (via drill 0.64)
  Top 0.406: LED38.A v28.91,26.75 LED37.C
N$110  (via drill 0.64)
  Top 0.406: LED39.C v26.75,28.91 LED40.A
N$111  (via drill 0.64)
  Top 0.406: LED41.C v25.09,31.47 LED42.A
N$112  (via drill 0.64)
  Top 0.406: LED43.C v23.99,34.32 LED44.A
N$113  (via drill 0.64)
  Top 0.406: LED46.A v23.52,37.34 LED45.C
N$114  (via drill 0.64)
  Top 0.406: LED48.A v23.68,40.38 LED47.C
N$115  (via drill 0.64)
  Top 0.406: LED50.A v24.46,43.33 LED49.C
N$116  (via drill 0.64)
  Top 0.406: LED52.A v25.85,46.05 LED51.C
N$117  (via drill 0.64)
  Top 0.406: LED53.C v27.77,48.43 LED54.A
N$118  (via drill 0.64)
  Top 0.406: LED56.A v30.15,50.35 LED55.C
N$119  (via drill 0.64)
  Top 0.406: LED58.A v32.87,51.73 LED57.C
N$120  (via drill 0.64)
  Top 0.406: LED60.A v35.81,52.52 LED59.C
N$121  (via drill 0.64)  (1 unrouted)
  Top 0.406: LED63.C 40.98,56.29 | LED62.A 40.98,56.29 | 44.7,55.29 LED64.A | LED65.C 44.7,55.29 | LED66.A 48.13,53.54 | LED67.C 48.13,53.54 | LED68.A 51.12,51.12 | LED69.C 51.12,51.12 | LED70.A 53.54,48.13 | LED71.C 53.54,48.13 | 40.98,56.29 v41.28,58.17 | 44.7,55.29 v45.38,57.07 | 48.13,53.54 v49.17,55.14 | 51.12,51.12 v52.47,52.47 | 53.54,48.13 v55.14,49.17
  Bottom 0.406: v55.14,49.17 arc12 v52.47,52.47 arc12 v49.17,55.14 arc12 v45.38,57.07 arc12 v41.28,58.17 arc9 38.1,58.42 SV1.2
N$126  (via drill 0.64)
  Top 0.406: LED72.A v55.29,44.7 LED73.C
N$127  (via drill 0.64)
  Top 0.406: LED74.A v56.29,40.98 LED75.C
N$128  (via drill 0.64)
  Top 0.406: LED76.A v56.49,37.14 LED77.C
N$129  (via drill 0.64)
  Top 0.406: LED78.A v55.89,33.33 LED79.C
N$130  (via drill 0.64)
  Top 0.406: LED80.A v54.51,29.74 LED81.C
N$131  (via drill 0.64)
  Top 0.406: LED82.A v52.41,26.51 LED83.C
N$132  (via drill 0.64)
  Top 0.406: LED84.A v49.69,23.79 LED85.C
N$133  (via drill 0.64)
  Top 0.406: LED86.A v46.46,21.69 LED87.C
N$134  (via drill 0.64)
  Top 0.406: LED88.A v42.87,20.31 LED89.C
N$135  (via drill 0.64)
  Top 0.406: LED90.A v39.06,19.71 LED91.C
N$136  (via drill 0.64)
  Top 0.406: LED92.A v35.22,19.91 LED93.C
N$137  (via drill 0.64)
  Top 0.406: LED94.A v31.5,20.91 LED95.C
N$138  (via drill 0.64)
  Top 0.406: LED96.A v28.07,22.66 LED97.C
N$139  (via drill 0.64)
  Top 0.406: LED98.A v25.08,25.08 LED99.C
N$140  (via drill 0.64)
  Top 0.406: LED100.A v22.66,28.07 LED101.C
N$141  (via drill 0.64)
  Top 0.406: LED102.A v20.91,31.5 LED103.C
N$142  (via drill 0.64)
  Top 0.406: LED105.C v19.91,35.22 LED104.A
N$143  (via drill 0.64)
  Top 0.406: LED106.A v19.71,39.06 LED107.C
N$144  (via drill 0.64)
  Top 0.406: LED109.C v20.31,42.87 LED108.A
N$145  (via drill 0.64)
  Top 0.406: LED111.C v21.69,46.46 LED110.A
N$146  (via drill 0.64)
  Top 0.406: LED113.C v23.79,49.69 LED112.A
N$147  (via drill 0.64)
  Top 0.406: LED115.C v26.51,52.41 LED114.A
N$148  (via drill 0.64)
  Top 0.406: LED117.C v29.74,54.51 LED116.A
N$149  (via drill 0.64)
  Top 0.406: LED119.C v33.33,55.89 LED118.A
N$150  (via drill 0.64)
  Top 0.406: LED61.C v37.14,56.49 LED120.A
N$156  (via drill 0.64)
  Top 0.406: LED131.C v57.9,48.19 LED132.A
N$157  (via drill 0.64)
  Top 0.406: LED133.C v59.57,43.85 LED134.A
N$158  (via drill 0.64)
  Top 0.406: LED135.C v60.3,39.26 LED136.A
N$159  (via drill 0.64)
  Top 0.406: LED137.C v60.05,34.62 LED138.A
N$160  (via drill 0.64)
  Top 0.406: LED139.C v58.85,30.14 LED140.A
N$161  (via drill 0.64)
  Top 0.406: LED141.C v56.74,26 LED142.A
N$162  (via drill 0.64)
  Top 0.406: LED143.C v53.81,22.39 LED144.A
N$163  (via drill 0.64)
  Top 0.406: LED145.C v50.2,19.46 LED146.A
N$164  (via drill 0.64)
  Top 0.406: LED147.C v46.06,17.35 LED148.A
N$165  (via drill 0.64)
  Top 0.406: LED149.C v41.58,16.15 LED150.A
N$166  (via drill 0.64)
  Top 0.406: LED151.C v36.94,15.9 LED152.A
N$167  (via drill 0.64)
  Top 0.406: LED153.C v32.35,16.63 LED154.A
N$168  (via drill 0.64)
  Top 0.406: LED155.C v28.01,18.3 LED156.A
N$169  (via drill 0.64)
  Top 0.406: LED157.C v24.11,20.83 LED158.A
N$170  (via drill 0.64)
  Top 0.406: LED160.A v20.83,24.11 LED159.C
N$171  (via drill 0.64)
  Top 0.406: LED162.A v18.3,28.01 LED161.C
N$172  (via drill 0.64)
  Top 0.406: LED163.C v16.63,32.35 LED164.A
N$173  (via drill 0.64)
  Top 0.406: LED166.A v15.9,36.94 LED165.C
N$174  (via drill 0.64)
  Top 0.406: LED168.A v16.15,41.58 LED167.C
N$175  (via drill 0.64)
  Top 0.406: LED170.A v17.35,46.06 LED169.C
N$176  (via drill 0.64)
  Top 0.406: LED172.A v19.46,50.2 LED171.C
N$177  (via drill 0.64)
  Top 0.406: LED174.A v22.39,53.81 LED173.C
N$178  (via drill 0.64)
  Top 0.406: LED176.A v26,56.74 LED175.C
N$179  (via drill 0.64)
  Top 0.406: LED178.A v30.14,58.85 LED177.C
N$180  (via drill 0.64)
  Top 0.406: LED180.A v34.62,60.05 LED179.C
VDD  (1 unrouted)
VSS  (1 unrouted)